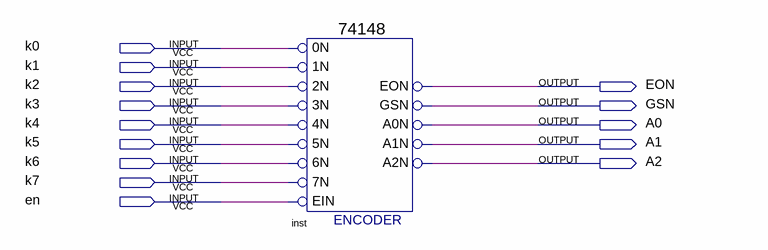
[diagram p0: schematic sheet]
// Quartus schematic encoder.bdf as structural Verilog: 1 symbols, 14 pins
module encoder (
  input  k0,
  input  k1,
  input  k2,
  input  k3,
  input  k4,
  input  k5,
  input  k6,
  input  k7,
  input  en,
  output EON,
  output GSN,
  output A0,
  output A1,
  output A2
);

  \74148  inst (
    .\5N (k5), .\0N (k0), .\1N (k1), .\2N (k2), .\3N (k3), .\4N (k4), .EIN(en), .\6N (k6), .\7N (k7),
    .A1N(A1), .A0N(A0), .A2N(A2), .EON(EON), .GSN(GSN));
endmodule
